# EAGLE design vco_main (EAGLE 7.2.0)
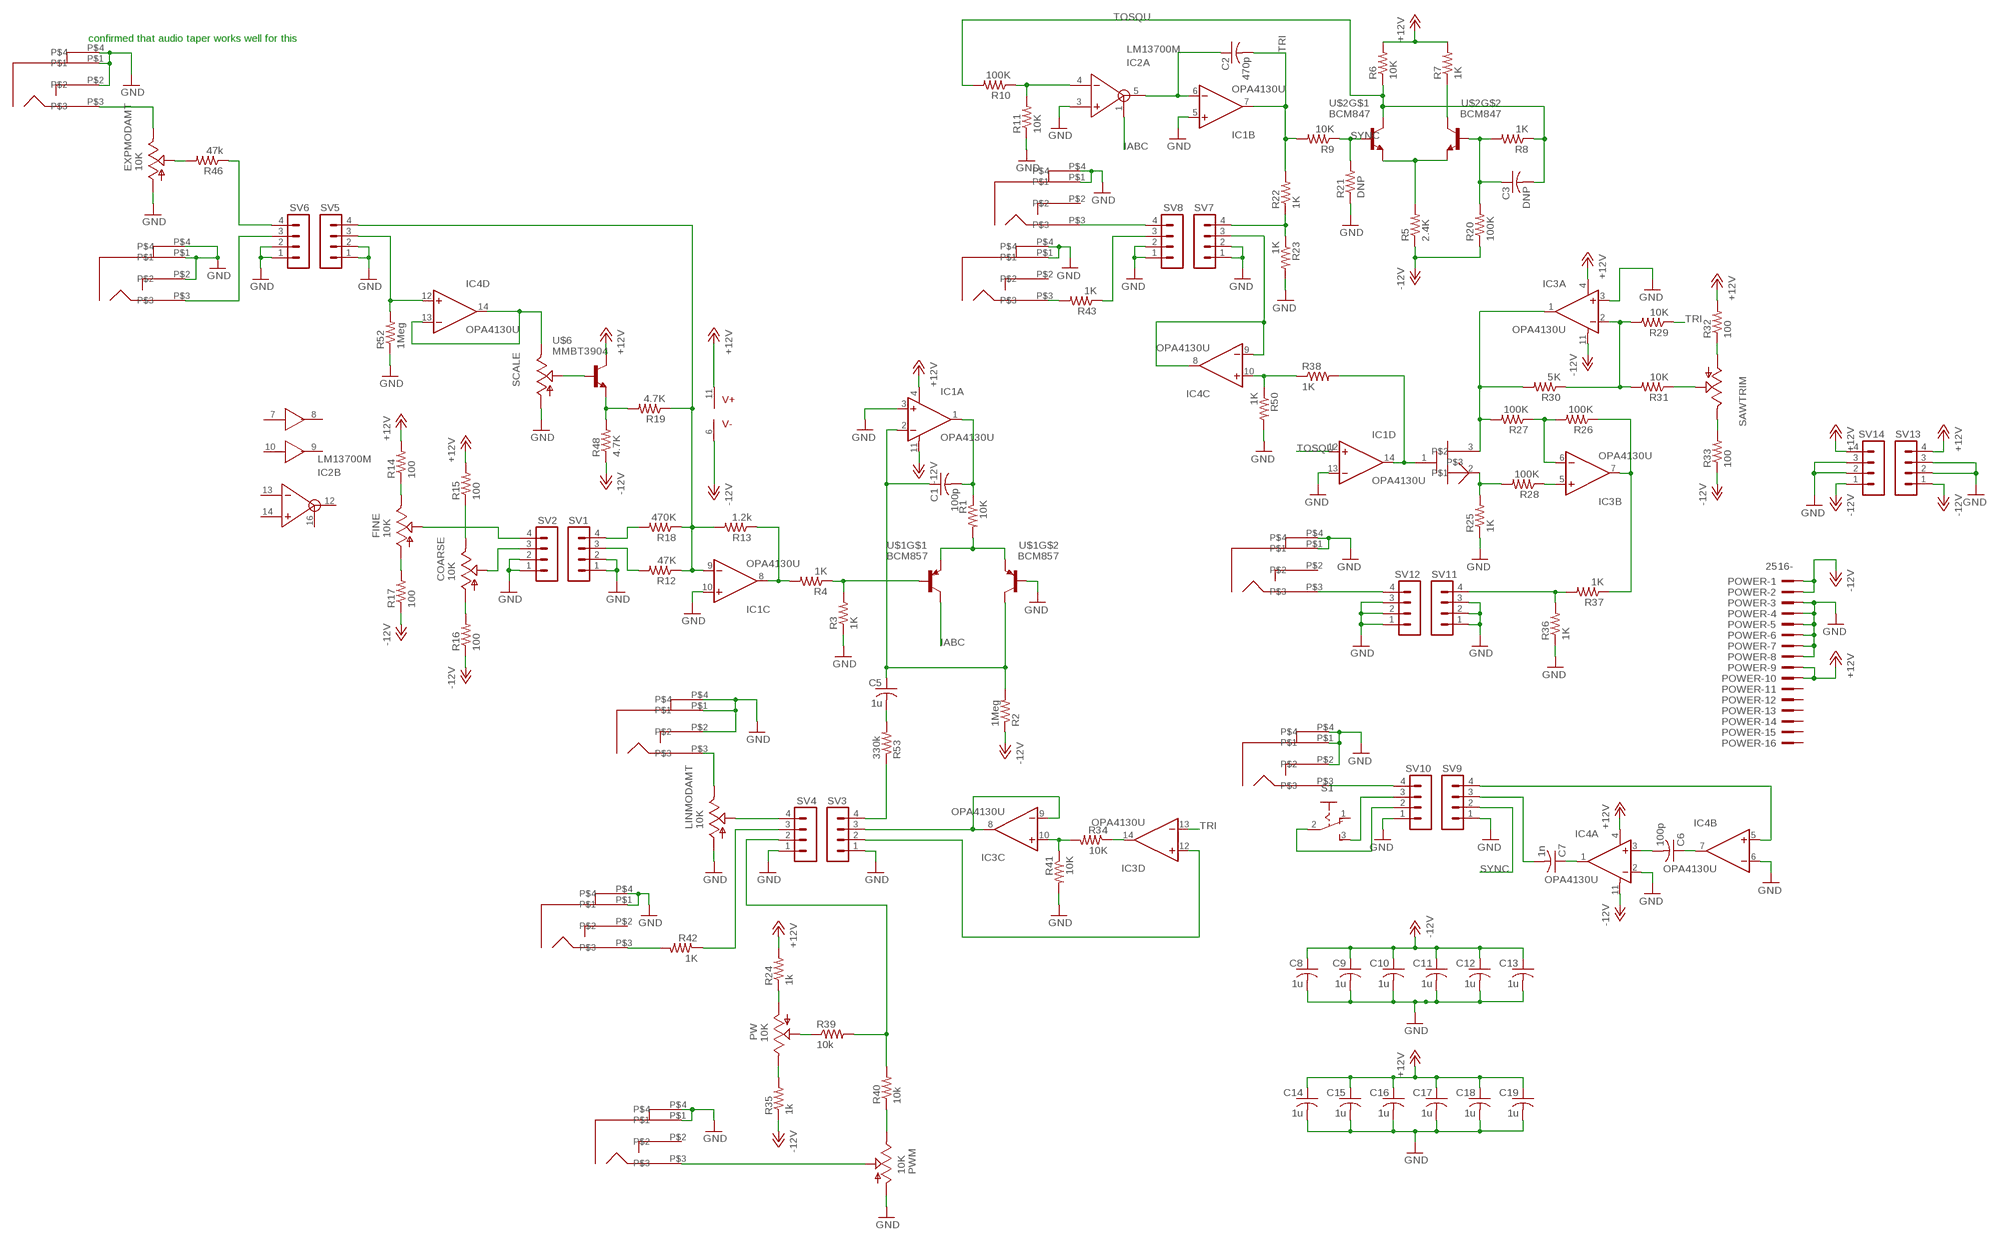
[diagram p0: schematic, sheet 1]

## Parts
C1  100p  C-USC0603  [C0603]
C2  470p  C-USC0603  [C0603]
C3  DNP  C-USC0603  [C0603]
C5  1u  C-USC0603  [C0603]
C6  100p  C-USC0603  [C0603]
C7  1n  C-USC0603  [C0603]
C8  1u  C-USC0603  [C0603]
C9  1u  C-USC0603  [C0603]
C10  1u  C-USC0603  [C0603]
C11  1u  C-USC0603  [C0603]
C12  1u  C-USC0603  [C0603]
C13  1u  C-USC0603  [C0603]
C14  1u  C-USC0603  [C0603]
C15  1u  C-USC0603  [C0603]
C16  1u  C-USC0603  [C0603]
C17  1u  C-USC0603  [C0603]
C18  1u  C-USC0603  [C0603]
C19  1u  C-USC0603  [C0603]
COARSE  10K  US-EVUF2J  [EVUFXJ]
EXPMOD  PJ301BM  [PJ301BM]
EXPMODAMT  10K  US-EVUF2J  [EVUFXJ]
FINE  10K  US-EVUF2J  [EVUFXJ]
IC1  OPA4130U  [SO14]
IC2  LM13700M  [SO16]
IC3  OPA4130U  [SO14]
IC4  OPA4130U  [SO14]
LINMOD  PJ301BM  [PJ301BM]
LINMODAMT  10K  US-EVUF2J  [EVUFXJ]
POWER  2516-  [PAK100/2500-16]
PW  10K  US-EVUF2J  [EVUFXJ]
PWIN  PJ301BM  [PJ301BM]
PWM  10K  US-EVUF2J  [EVUFXJ]
PWOUT  PJ301BM  [PJ301BM]
R1  10K  R-US_R0603  [R0603]
R2  1Meg  R-US_R0603  [R0603]
R3  1K  R-US_R0603  [R0603]
R4  1K  R-US_R0603  [R0603]
R5  2.4K  R-US_R0603  [R0603]
R6  10K  R-US_R0603  [R0603]
R7  1K  R-US_R0603  [R0603]
R8  1K  R-US_R0603  [R0603]
R9  10K  R-US_R0603  [R0603]
R10  100K  R-US_R0603  [R0603]
R11  10K  R-US_R0603  [R0603]
R12  47K  R-US_R0603  [R0603]
R13  1.2k  R-US_R0603  [R0603]
R14  100  R-US_R0603  [R0603]
R15  100  R-US_R0603  [R0603]
R16  100  R-US_R0603  [R0603]
R17  100  R-US_R0603  [R0603]
R18  470K  R-US_R0603  [R0603]
R19  4.7K  R-US_R0603  [R0603]
R20  100K  R-US_R0603  [R0603]
R21  DNP  R-US_R0603  [R0603]
R22  1K  R-US_R0603  [R0603]
R23  1K  R-US_R0603  [R0603]
R24  1k  R-US_R0603  [R0603]
R25  1K  R-US_R0603  [R0603]
R26  100K  R-US_R0603  [R0603]
R27  100K  R-US_R0603  [R0603]
R28  100K  R-US_R0603  [R0603]
R29  10K  R-US_R0603  [R0603]
R30  5K  R-US_R0603  [R0603]
R31  10K  R-US_R0603  [R0603]
R32  100  R-US_R0603  [R0603]
R33  100  R-US_R0603  [R0603]
R34  10K  R-US_R0603  [R0603]
R35  1k  R-US_R0603  [R0603]
R36  1K  R-US_R0603  [R0603]
R37  1K  R-US_R0603  [R0603]
R38  1K  R-US_R0603  [R0603]
R39  10k  R-US_R0603  [R0603]
R40  10k  R-US_R0603  [R0603]
R41  10K  R-US_R0603  [R0603]
R42  1K  R-US_R0603  [R0603]
R43  1K  R-US_R0603  [R0603]
R46  47k  R-US_R0603  [R0603]
R48  4.7K  R-US_R0603  [R0603]
R50  1K  R-US_R0603  [R0603]
R52  1Meg  R-US_R0603  [R0603]
R53  330k  R-US_R0603  [R0603]
S1  255SB  [255SB]
SAW  PJ301BM  [PJ301BM]
SAWTRIM  TRIM_US-B64Y  [B64Y]
SCALE  TRIM_US-B64Y  [B64Y]
SQUARE  PJ301BM  [PJ301BM]
SV1  MA04-1  [MA04-1]
SV2  MA04-1  [MA04-1]
SV3  MA04-1  [MA04-1]
SV4  MA04-1  [MA04-1]
SV5  MA04-1  [MA04-1]
SV6  MA04-1  [MA04-1]
SV7  MA04-1  [MA04-1]
SV8  MA04-1  [MA04-1]
SV9  MA04-1  [MA04-1]
SV10  MA04-1  [MA04-1]
SV11  MA04-1  [MA04-1]
SV12  MA04-1  [MA04-1]
SV13  MA04-1  [MA04-1]
SV14  MA04-1  [MA04-1]
SYNC  PJ301BM  [PJ301BM]
TRIOUT  PJ301BM  [PJ301BM]
U$1  BCM857  [SOT457R_PHILIPS]
U$2  BCM847  [SOT457R_PHILIPS]
U$3  2N7000  [SOT23]
U$6  MMBT3904  [SOT23]
VPEROCT  PJ301BM  [PJ301BM]

## Nets
+12V: C14.1 C15.1 C16.1 C17.1 C18.1 C19.1 IC1.4(A:V+) IC2.11(V+) IC3.4(A:V+) IC4.4(A:V+) POWER.9 POWER.10 R6.2 R7.2 R14.2 R15.2 R24.2 R32.2 SV13.4 SV14.4 U$6.3(C)
-12V: C8.1 C9.1 C10.1 C11.1 C12.1 C13.1 IC1.11(A:V-) IC2.6(V-) IC3.11(A:V-) IC4.11(A:V-) POWER.1 POWER.2 R2.1 R5.1 R16.1 R17.1 R20.1 R33.1 R35.1 R48.1 SV13.1 SV14.1
GND: C8.2 C9.2 C10.2 C11.2 C12.2 C13.2 C14.2 C15.2 C16.2 C17.2 C18.2 C19.2 EXPMOD.P$1 EXPMOD.P$2 EXPMOD.P$4 EXPMODAMT.1(A) IC1.3(A:+IN) IC1.5(B:+IN) IC1.10(C:+IN) IC1.13(D:-IN) IC2.3(A:+IN) IC3.3(A:+IN) IC4.2(A:-IN) IC4.6(B:-IN) LINMOD.P$1 LINMOD.P$2 LINMOD.P$4 LINMODAMT.1(A) POWER.3 POWER.4 POWER.5 POWER.6 POWER.7 POWER.8 PWIN.P$1 PWIN.P$4 PWM.1(A) PWOUT.P$1 PWOUT.P$4 R3.1 R11.1 R21.1 R23.2 R25.1 R36.1 R41.2 R50.2 R52.1 SAW.P$1 SAW.P$4 SCALE.A SQUARE.P$1 SQUARE.P$4 SV1.1 SV1.2 SV2.1 SV2.2 SV3.1 SV4.1 SV5.1 SV5.2 SV6.1 SV6.2 SV7.1 SV7.2 SV8.1 SV8.2 SV9.1 SV10.1 SV11.1 SV11.2 SV11.3 SV12.1 SV12.2 SV12.3 SV13.2 SV13.3 SV14.2 SV14.3 SYNC.P$1 SYNC.P$2 SYNC.P$4 TRIOUT.P$1 TRIOUT.P$4 U$1.5(B) VPEROCT.P$1 VPEROCT.P$2 VPEROCT.P$4
IABC: IC2.1(A:IABC) U$1.6(C)
N$1: IC3.14(D:OUT) R34.1
N$2: C1.2 IC1.1(A:OUT) R1.1
N$3: C1.1 C5.1 IC1.2(A:-IN) R2.2 U$1.3(C)
N$4: C3.1 R8.2 R20.2 U$2.5(B)
N$5: IC1.9(C:-IN) R12.1 R13.2 R18.1 R19.1 SV5.4
N$6: C6.2 IC4.3(A:+IN)
N$7: R3.2 R4.1 U$1.2(B)
N$8: FINE.3(E) R14.1
N$9: IC4.10(C:+IN) R38.1 R50.1
N$10: R25.2 R28.2 U$3.2
N$11: R5.2 U$2.1(E) U$2.4(E)
N$12: R1.2 U$1.1(E) U$1.4(E)
N$13: R22.1 R23.1 SV7.4
N$14: IC2.4(A:-IN) R10.1 R11.2
N$15: IC1.8(C:OUT) R4.2 R13.1
N$16: COARSE.3(E) R15.1
N$17: COARSE.1(A) R16.2
N$18: COARSE.2(S) SV2.3
N$19: C2.1 IC1.6(B:-IN) IC2.5(A:OUT)
N$20: FINE.1(A) R17.2
N$21: FINE.2(S) SV2.4
N$22: R19.2 R48.2 U$6.2(E)
N$23: R7.1 U$2.3(C)
N$24: LINMOD.P$3 LINMODAMT.3(E)
N$25: IC3.5(B:+IN) R28.1
N$26: IC3.6(B:-IN) R26.2 R27.1
N$27: IC3.7(B:OUT) R26.1 R37.1
N$28: IC3.1(A:OUT) R27.2 R30.2 U$3.3
N$29: R32.1 SAWTRIM.A
N$30: IC3.2(A:-IN) R29.2 R30.1 R31.2
N$31: R33.2 SAWTRIM.E
N$32: R31.1 SAWTRIM.S
N$33: PWOUT.P$3 R42.2
N$34: IC3.10(C:+IN) R34.2 R41.1
N$35: R43.2 SQUARE.P$3
N$36: IC3.8(C:OUT) IC3.9(C:-IN) SV3.3
N$37: R36.2 R37.2 SV11.4
N$38: R39.2 R40.2 SV4.2
N$39: PW.2(S) R39.1
N$40: IC4.8(C:OUT) IC4.9(C:-IN) SV7.3
N$41: PW.1(A) R24.1
N$42: EXPMODAMT.2(S) R46.2
N$43: PW.3(E) R35.2
N$44: PWM.3(E) R40.1
N$45: EXPMOD.P$3 EXPMODAMT.3(E)
N$46: R53.1 SV3.4
N$47: C6.1 IC4.7(B:OUT)
N$48: C5.2 R53.2
N$49: C7.1 IC4.1(A:OUT)
N$50: SV10.4 SYNC.P$3
N$51: C7.2 SV9.3
N$52: SAW.P$3 SV12.4
N$53: R18.2 SV1.4
N$54: IC4.12(D:+IN) R52.2 SV5.3
N$55: IC4.13(D:-IN) IC4.14(D:OUT) SCALE.E
N$56: SCALE.S U$6.1(B)
N$57: IC1.14(D:OUT) R38.2 U$3.1
N$58: R12.2 SV1.3
N$60: LINMODAMT.2(S) SV4.4
N$61: R42.1 SV4.3
N$62: R46.1 SV6.4
N$63: SV6.3 VPEROCT.P$3
N$64: SV8.4 TRIOUT.P$3
N$65: R43.1 SV8.3
N$66: IC4.5(B:+IN) SV9.4
N$67: S1.3(S) SV10.3
N$68: S1.2(P) SV10.2
N$71: IC3.12(D:+IN) SV3.2
N$72: PWIN.P$3 PWM.2(S)
SYNC: R9.1 R21.2 SV9.2 U$2.2(B)
TOSQU: C3.2 IC1.12(D:+IN) R6.1 R8.1 R10.2 U$2.6(C)
TRI: C2.2 IC1.7(B:OUT) IC3.13(D:-IN) R9.2 R22.2 R29.1
Unconnected: IC2.7(IN) IC2.8(OUT) IC2.9(OUT) IC2.10(IN) IC2.12(B:OUT) IC2.13(B:-IN) IC2.14(B:+IN) IC2.16(B:IABC) POWER.11 POWER.12 POWER.13 POWER.14 POWER.15 POWER.16 PWIN.P$2 PWOUT.P$2 S1.1(O) SAW.P$2 SQUARE.P$2 TRIOUT.P$2

## Notes on the sheet
- confirmed that audio taper works well for this

## Library data of the parts
C1-C3 C5-C19 = dan:C-US: CAPACITOR, American symbol
COARSE EXPMODAMT FINE LINMODAMT PW PWM = dan:US-EVU: 9 mm Square Rotary Potentiometers Source: Panasonic
EXPMOD LINMOD PWIN PWOUT SAW SQUARE SYNC TRIOUT VPEROCT = dan:PJ301BM
IC1 IC3 IC4 = dan:OPA4130: Low Power, Precision FET-Input Operational Amplifiers; MF: TEXAS INSTRUMENTS; MPN: OPA4130UA; OC_FARNELL: 1648707; OC_NEWARK: 80K8080
IC2 = dan:LM13700: National Dual OTA with buffers.
POWER = dan:2516-: 3M (TM) Pak 100 4-Wall Header Source: 3M; OC_FARNELL: unknown; OC_NEWARK: unknown
R1-R43 R46 R48 R50 R52 R53 = dan:R-US_: RESISTOR, American symbol
S1 = dan:255SB: SLIDING SWITCH Distributor Buerklin, 11G810
SAWTRIM SCALE = dan:TRIM_US-: POTENTIOMETER
SV1-SV14 = dan:MA04-1: PIN HEADER; OC_FARNELL: unknown; OC_NEWARK: unknown
U$1 = dan:BCM857
U$2 = dan:BCM847
U$3 = dan:2N7000
U$6 = dan:MMBT3904

## Board
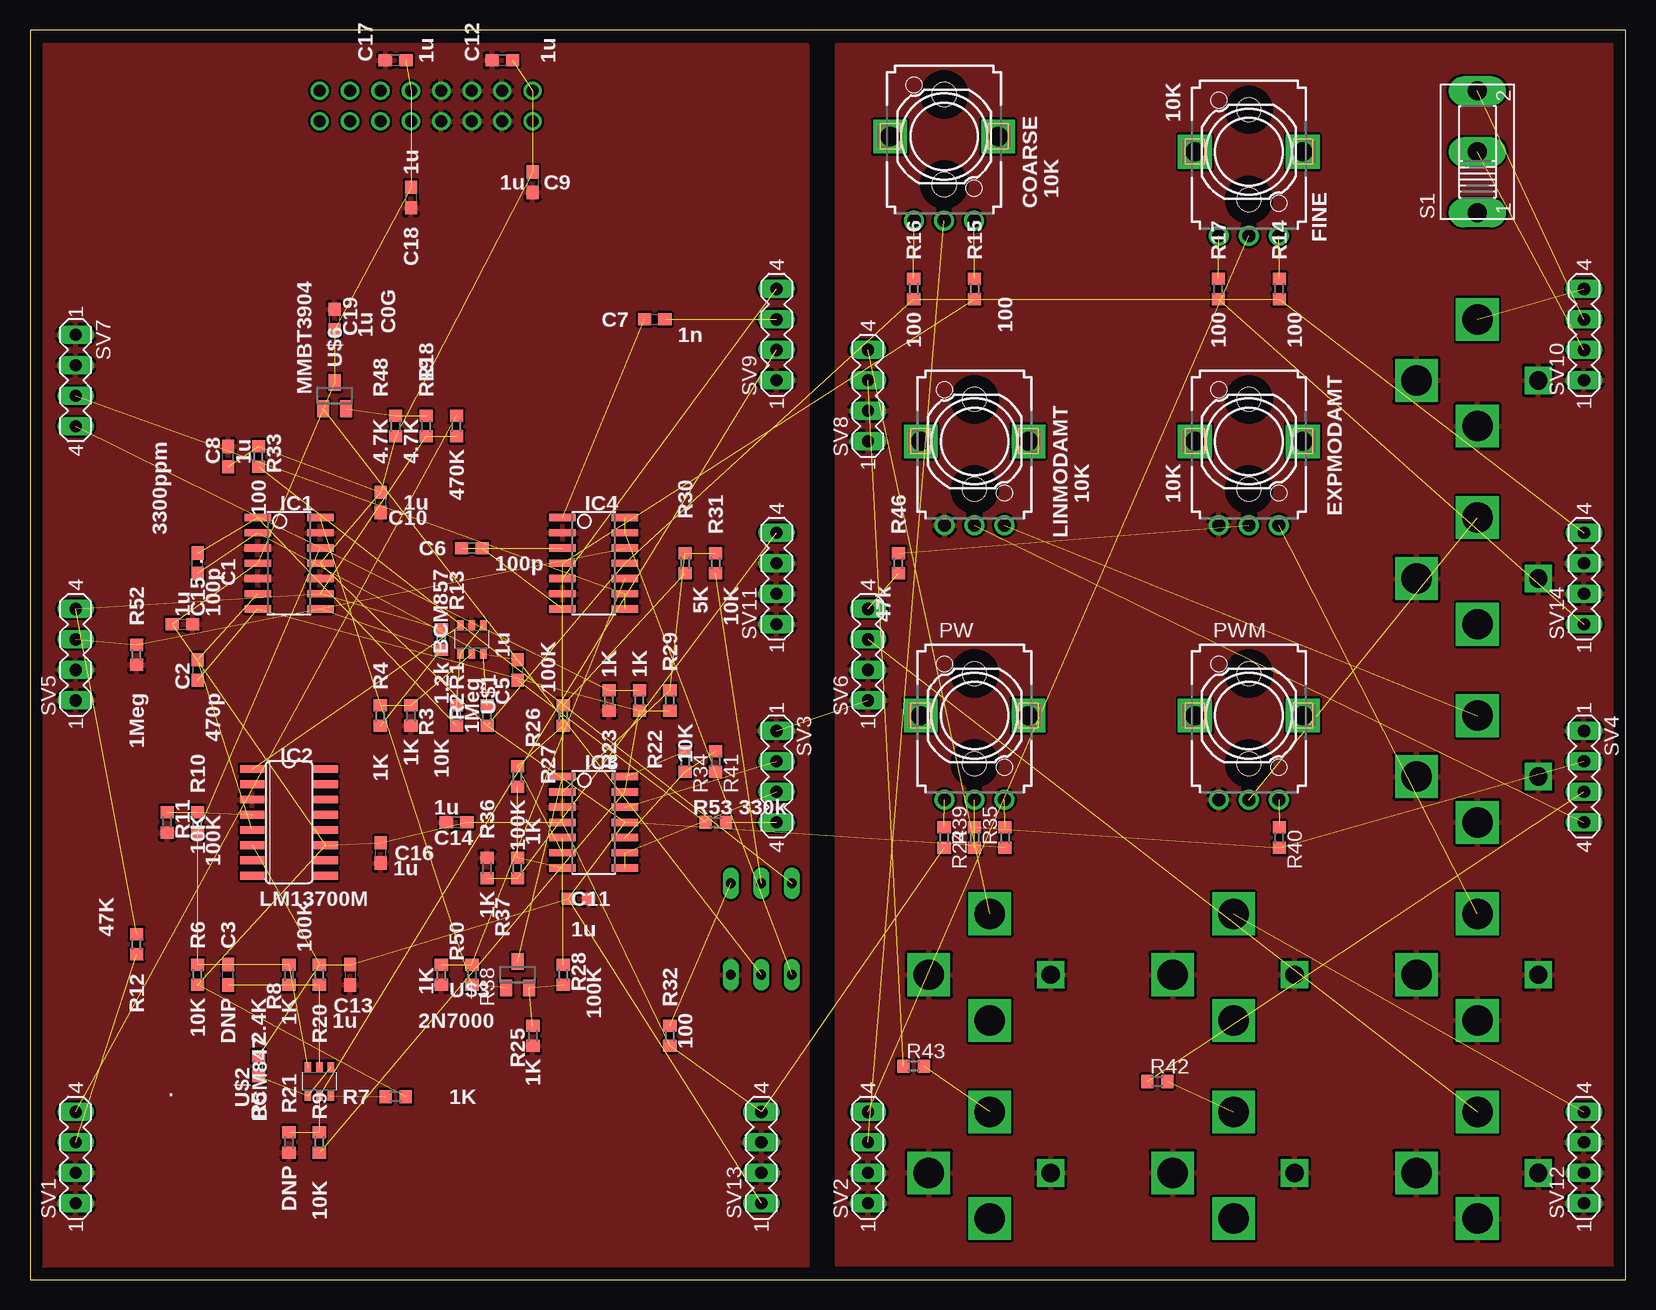
[diagram p1: board, top side]
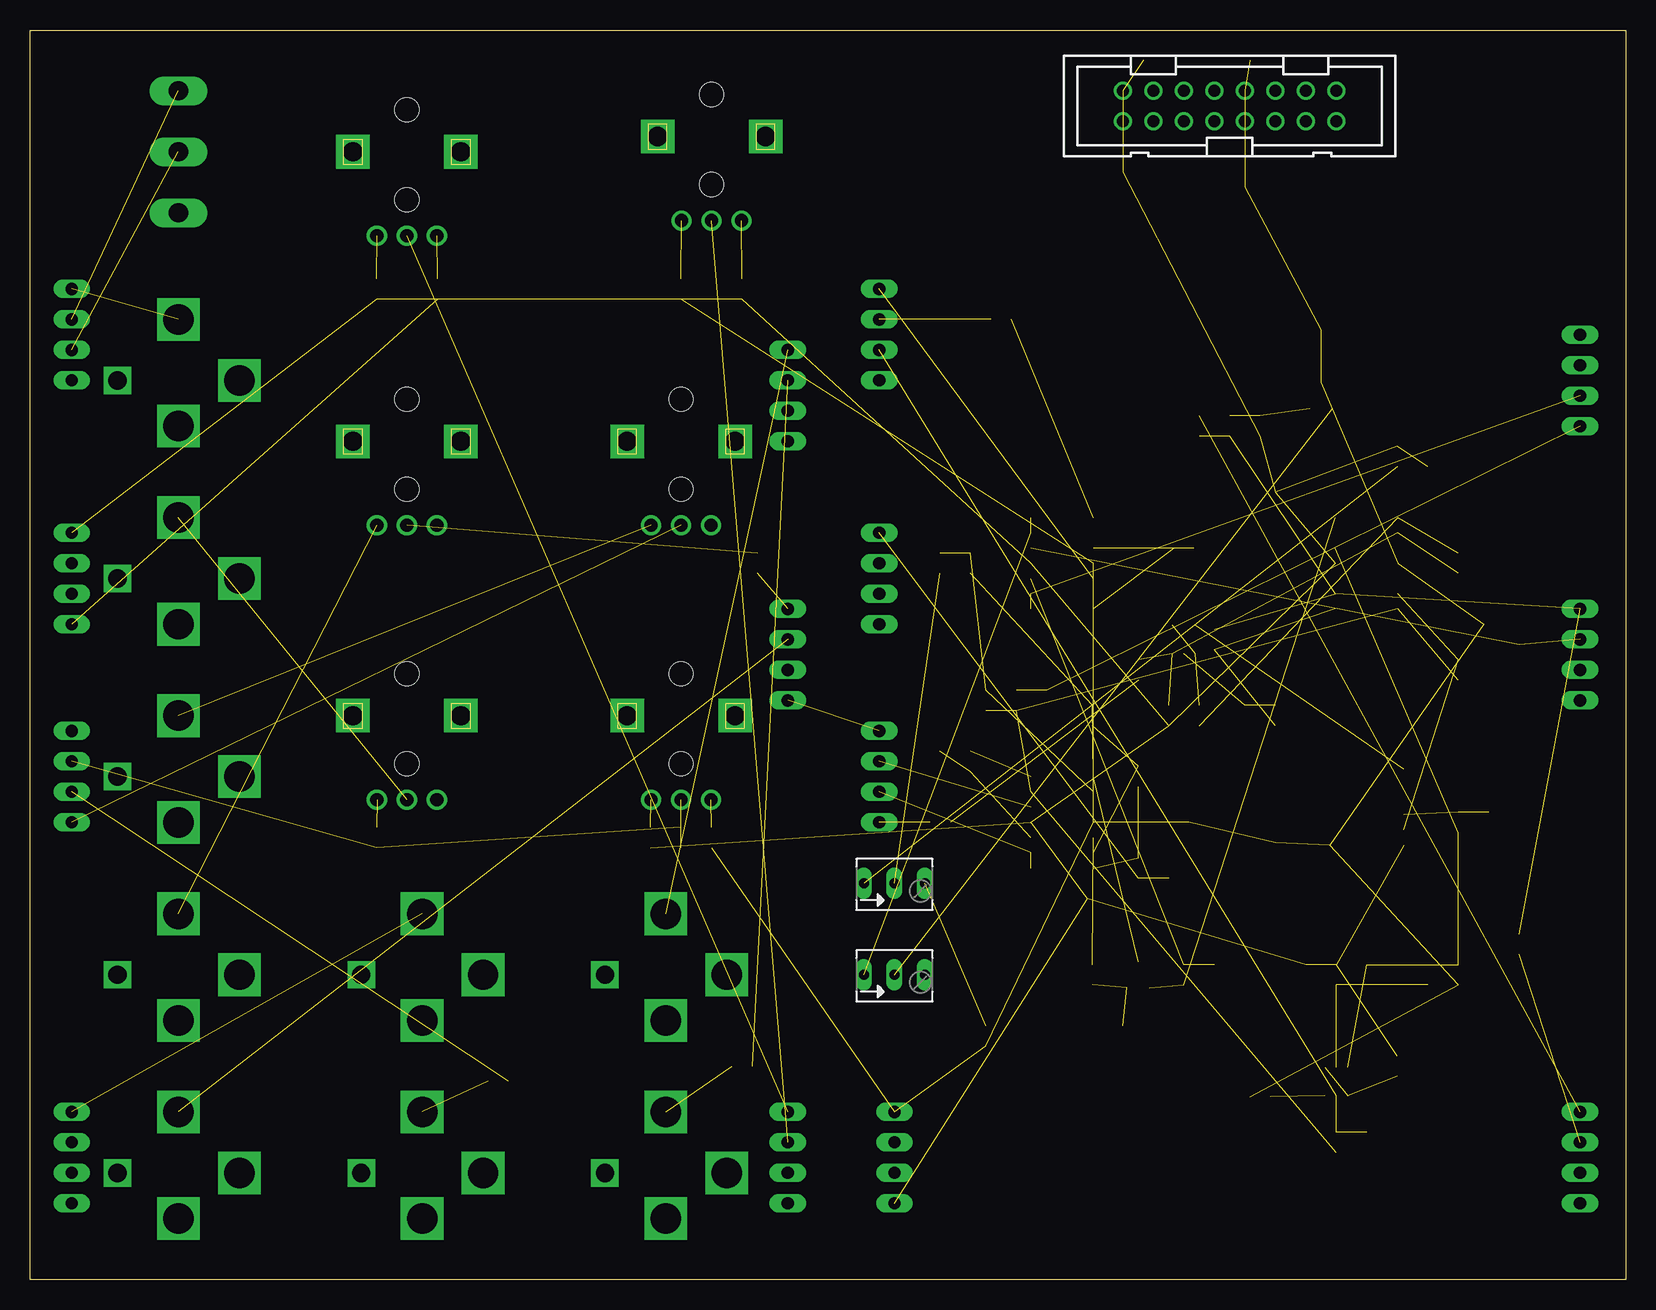
[diagram p2: board, bottom side, seen from below]

Size 133.02 x 104.13 mm. Coordinates in mm from the lower left corner, seen from the top.
Outline: 0,0 133.02,0 133.02,104.13 0,104.13 0,0
Copper layers (1*16): Top 0.035mm / dielectric 1.5mm / Bottom 0.035mm
Design rules "default *": minimum track width 10mil, minimum drill 20mil, track to track 8mil, track to pad 8mil, pad to pad 8mil, via to via 8mil, smd to smd 8mil, copper to edge 40mil, drill to drill 8mil, minimum pad ring 10mil, minimum via ring 8mil, stop-mask expansion 4mil, vias tented up to drill 0mil, thermal gap 10mil

### Footprints (pad centres in the part's own frame; a part is rotated, then mirrored left to right if it is on the bottom)
C0603 = smd 1.1 x 1: 1 -0.85,0; 2 0.85,0
EVUFXJ = drill 1.1 pad 1.676: 1 -2.5,-7; 2 0,-7; 3 2.5,-7 | drill 1.6 pad 2.8 square: M1 4.5,0; M2 -4.5,0 | hole 2: 0,3.5; 0,-4
PJ301BM = drill 1.524 square: P$1 5.08,0 | drill 2.54 square: P$2 0,-3.81; P$3 0,5.08; P$4 -5.08,0
SO14 = smd 0.61 x 2.21: 1 -3.81,-2.603; 2 -2.54,-2.603; 3 -1.27,-2.603; 4 0,-2.603; 5 1.27,-2.603; 6 2.54,-2.603; 7 3.81,-2.603; 8 3.81,2.603; 9 2.54,2.603; 10 1.27,2.603; 11 0,2.603; 12 -1.27,2.603; 13 -2.54,2.603; 14 -3.81,2.603
SO16 = smd 0.66 x 2.032: 1 -4.445,-3.073; 2 -3.175,-3.073; 3 -1.905,-3.073; 4 -0.635,-3.073; 5 0.635,-3.073; 6 1.905,-3.073; 7 3.175,-3.073; 8 4.445,-3.073; 9 4.445,3.073; 10 3.175,3.073; 11 1.905,3.073; 12 0.635,3.073; 13 -0.635,3.073; 14 -1.905,3.073; 15 -3.175,3.073; 16 -4.445,3.073
PAK100/2500-16 = drill 1 pad 1.422: 1 -8.89,-1.27; 2 -8.89,1.27; 3 -6.35,-1.27; 4 -6.35,1.27; 5 -3.81,-1.27; 6 -3.81,1.27; 7 -1.27,-1.27; 8 -1.27,1.27; 9 1.27,-1.27; 10 1.27,1.27; 11 3.81,-1.27; 12 3.81,1.27; 13 6.35,-1.27; 14 6.35,1.27; 15 8.89,-1.27; 16 8.89,1.27
R0603 = smd 1 x 1.1: 1 -0.85,0; 2 0.85,0
255SB = drill 1.6 long: 1 -5.08,0; 2 0,0; 3 5.08,0
B64Y = drill 0.813 long: A 2.54,0; E -2.54,0; S 0,0
MA04-1 = drill 1.016 long: 1 -3.81,0; 2 -1.27,0; 3 1.27,0; 4 3.81,0
SOT457R_PHILIPS = smd 0.55 x 0.8: 1 -0.95,-1.2; 2 0,-1.2; 3 0.95,-1.2; 4 0.95,1.2; 5 0,1.2; 6 -0.95,1.2
SOT23 = smd 1 x 1.4: 1 -0.95,-1.1; 2 0.95,-1.1; 3 0,1.1

### Placement (x,y rotation side)
C1  13.97,59.69 90 top
C2  13.97,50.8 270 top
C3  16.51,25.4 90 top
C5  40.64,50.8 270 top
C6  36.83,60.96 180 top
C7  52.07,80.01 0 top
C8  16.51,68.58 90 top
C9  41.91,91.44 270 top
C10  29.21,64.77 270 top
C11  45.72,31.75 0 top
C12  39.37,101.6 180 top
C13  26.67,25.4 270 top
C14  35.56,38.1 180 top
C15  12.7,54.61 0 top
C16  29.21,35.56 270 top
C17  30.48,101.6 180 top
C18  31.75,90.17 270 top
C19  25.4,80.01 90 top
COARSE  76.2,95.25 0 top
EXPMOD  120.65,25.4 0 top
EXPMODAMT  101.6,69.85 0 top
FINE  101.6,93.98 0 top
IC1  21.59,59.69 270 top
IC2  21.59,38.1 270 top
IC3  46.99,38.1 270 top
IC4  46.99,59.69 270 top
LINMOD  120.65,41.91 0 top
LINMODAMT  78.74,69.85 0 top
POWER  33.02,97.79 0 bottom
PW  78.74,46.99 0 top
PWIN  120.65,58.42 0 top
PWM  101.6,46.99 0 top
PWOUT  100.33,8.89 0 top
R1  35.56,46.99 90 top
R2  38.1,46.99 90 top
R3  31.75,46.99 90 top
R4  29.21,46.99 270 top
R5  19.05,17.78 270 top
R6  13.97,25.4 270 top
R7  30.48,15.24 0 top
R8  21.59,25.4 270 top
R9  24.13,11.43 270 top
R10  13.97,38.1 270 top
R11  11.43,38.1 90 top
R12  8.89,27.94 270 top
R13  34.29,53.34 90 top
R14  104.14,82.55 270 top
R15  78.74,82.55 270 top
R16  73.66,82.55 90 top
R17  99.06,82.55 90 top
R18  35.56,71.12 90 top
R19  33.02,71.12 90 top
R20  24.13,25.4 270 top
R21  21.59,11.43 90 top
R22  50.8,48.26 270 top
R23  48.26,48.26 270 top
R24  76.2,36.83 270 top
R25  41.91,20.32 90 top
R26  40.64,41.91 90 top
R27  44.45,46.99 90 top
R28  44.45,25.4 270 top
R29  53.34,48.26 90 top
R30  54.61,59.69 270 top
R31  57.15,59.69 90 top
R32  53.34,20.32 270 top
R33  19.05,68.58 270 top
R34  54.61,43.18 270 top
R35  81.28,36.83 90 top
R36  38.1,34.29 270 top
R37  40.64,34.29 270 top
R38  36.83,25.4 270 top
R39  78.74,36.83 90 top
R40  104.14,36.83 270 top
R41  57.15,43.18 270 top
R42  93.98,16.51 0 top
R43  73.66,17.78 0 top
R46  72.39,59.69 90 top
R48  30.48,71.12 90 top
R50  34.29,25.4 270 top
R52  8.89,52.07 90 top
R53  57.15,38.1 180 top
S1  120.65,93.98 90 top
SAW  100.33,25.4 0 top
SAWTRIM  60.96,33.02 0 bottom
SCALE  60.96,25.4 0 bottom
SQUARE  80.01,8.89 0 top
SV1  3.81,10.16 90 top
SV2  69.85,10.16 90 top
SV3  62.23,41.91 270 top
SV4  129.54,41.91 270 top
SV5  3.81,52.07 90 top
SV6  69.85,52.07 90 top
SV7  3.81,74.93 270 top
SV8  69.85,73.66 90 top
SV9  62.23,78.74 90 top
SV10  129.54,78.74 90 top
SV11  62.23,58.42 90 top
SV12  129.54,10.16 90 top
SV13  60.96,10.16 90 top
SV14  129.54,58.42 90 top
SYNC  120.65,74.93 0 top
TRIOUT  80.01,25.4 0 top
U$1  36.83,53.34 0 top
U$2  24.13,16.51 0 top
U$3  40.64,25.4 0 top
U$6  25.4,73.66 0 top
VPEROCT  120.65,8.89 0 top

### Tracks (layer width: path | path; a pad name or v marks a point on that pad's centre or on a via)
+12V  (20 unrouted)
-12V  (21 unrouted)
GND  (1 unrouted)
  pour Top: 0,0 0,102.87 64.77,102.87 64.77,0
  pour Top: 67.31,102.87 132.08,102.87 132.08,1.27 67.31,1.27
IABC  (1 unrouted)
N$1  (1 unrouted)
N$2  (2 unrouted)
N$3  (4 unrouted)
N$4  (3 unrouted)
N$5  (5 unrouted)
N$6  (1 unrouted)
N$7  (2 unrouted)
N$8  (1 unrouted)
N$9  (2 unrouted)
N$10  (2 unrouted)
N$11  (2 unrouted)
N$12  (2 unrouted)
N$13  (2 unrouted)
N$14  (2 unrouted)
N$15  (2 unrouted)
N$16  (1 unrouted)
N$17  (1 unrouted)
N$18  (1 unrouted)
N$19  (2 unrouted)
N$20  (1 unrouted)
N$21  (1 unrouted)
N$22  (2 unrouted)
N$23  (1 unrouted)
N$24  (1 unrouted)
N$25  (1 unrouted)
N$26  (2 unrouted)
N$27  (2 unrouted)
N$28  (3 unrouted)
N$29  (1 unrouted)
N$30  (3 unrouted)
N$31  (1 unrouted)
N$32  (1 unrouted)
N$33  (1 unrouted)
N$34  (2 unrouted)
N$35  (1 unrouted)
N$36  (2 unrouted)
N$37  (2 unrouted)
N$38  (2 unrouted)
N$39  (1 unrouted)
N$40  (2 unrouted)
N$41  (1 unrouted)
N$42  (1 unrouted)
N$43  (1 unrouted)
N$44  (1 unrouted)
N$45  (1 unrouted)
N$46  (1 unrouted)
N$47  (1 unrouted)
N$48  (1 unrouted)
N$49  (1 unrouted)
N$50  (1 unrouted)
N$51  (1 unrouted)
N$52  (1 unrouted)
N$53  (1 unrouted)
N$54  (2 unrouted)
N$55  (2 unrouted)
N$56  (1 unrouted)
N$57  (2 unrouted)
N$58  (1 unrouted)
N$60  (1 unrouted)
N$61  (1 unrouted)
N$62  (1 unrouted)
N$63  (1 unrouted)
N$64  (1 unrouted)
N$65  (1 unrouted)
N$66  (1 unrouted)
N$67  (1 unrouted)
N$68  (1 unrouted)
N$71  (1 unrouted)
N$72  (1 unrouted)
SYNC  (3 unrouted)
TOSQU  (5 unrouted)
TRI  (5 unrouted)

### Text on the board
tPlace: C0G | 3300ppm | . | .